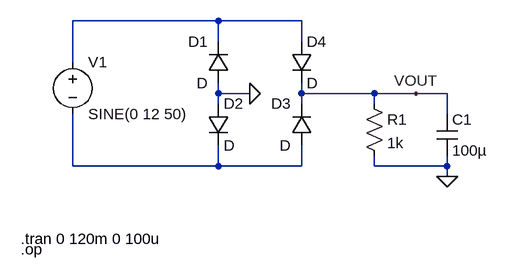
[diagram p0: schematic bridge_rectifier_filter.asc]
bridge_rectifier_filter.asc, the LTspice schematic file:
Version 4
SHEET 1 2100 1400
WIRE 352 160 128 160
WIRE 480 160 352 160
WIRE 352 192 352 160
WIRE 480 192 480 160
WIRE 128 224 128 160
WIRE 352 272 352 256
WIRE 400 272 352 272
WIRE 480 272 480 256
WIRE 592 272 480 272
WIRE 656 272 592 272
WIRE 704 272 656 272
WIRE 352 288 352 272
WIRE 480 288 480 272
WIRE 592 288 592 272
WIRE 704 304 704 272
WIRE 128 384 128 304
WIRE 352 384 352 352
WIRE 352 384 128 384
WIRE 480 384 480 352
WIRE 480 384 352 384
WIRE 592 384 592 368
WIRE 704 384 704 368
WIRE 704 384 592 384
WIRE 704 400 704 384
FLAG 400 272 0
FLAG 704 400 0
FLAG 656 272 VOUT
SYMBOL voltage 128 208 R0
SYMATTR InstName V1
SYMATTR Value SINE(0 12 50)
SYMBOL Diode 368 256 R180
WINDOW 0 32 64 Left 2
WINDOW 3 32 0 Left 2
SYMATTR InstName D1
SYMBOL Diode 336 288 R0
SYMATTR InstName D2
SYMBOL Diode 496 352 R180
WINDOW 0 32 64 Left 2
WINDOW 3 32 0 Left 2
SYMATTR InstName D3
SYMBOL Diode 464 192 R0
SYMATTR InstName D4
SYMBOL Res 576 272 R0
SYMATTR InstName R1
SYMATTR Value 1k
SYMBOL Cap 688 304 R0
SYMATTR InstName C1
SYMATTR Value 100µ
TEXT 48 496 Left 2 !.tran 0 120m 0 100u
TEXT 48 512 Left 2 !.op

The netlist it stands for:
* bridge_rectifier_filter.asc
V1 N001 N002 SINE(0 12 50)
D1 0 N001 D
D2 0 N002 D
D3 N002 VOUT D
D4 N001 VOUT D
R1 VOUT 0 1k
C1 VOUT 0 100µ
.model D D
.lib standard.dio
.tran 0 120m 0 100u
.op
.backanno
.end